# Altium schematic sheet dsau-micro-zed-bank35.SchDoc: dSAU Motherboard - uZed BANK35
size Letter; Engineer: Christopher J. Woodall; Organization: Boston University EDF/ECE; DocumentNumber: 9; Revision: A; SheetNumber: 9; SheetTotal: 10; EMAIL: cwoodall@bu.edu; TeamName: Team 19; ProjectName: dSAU
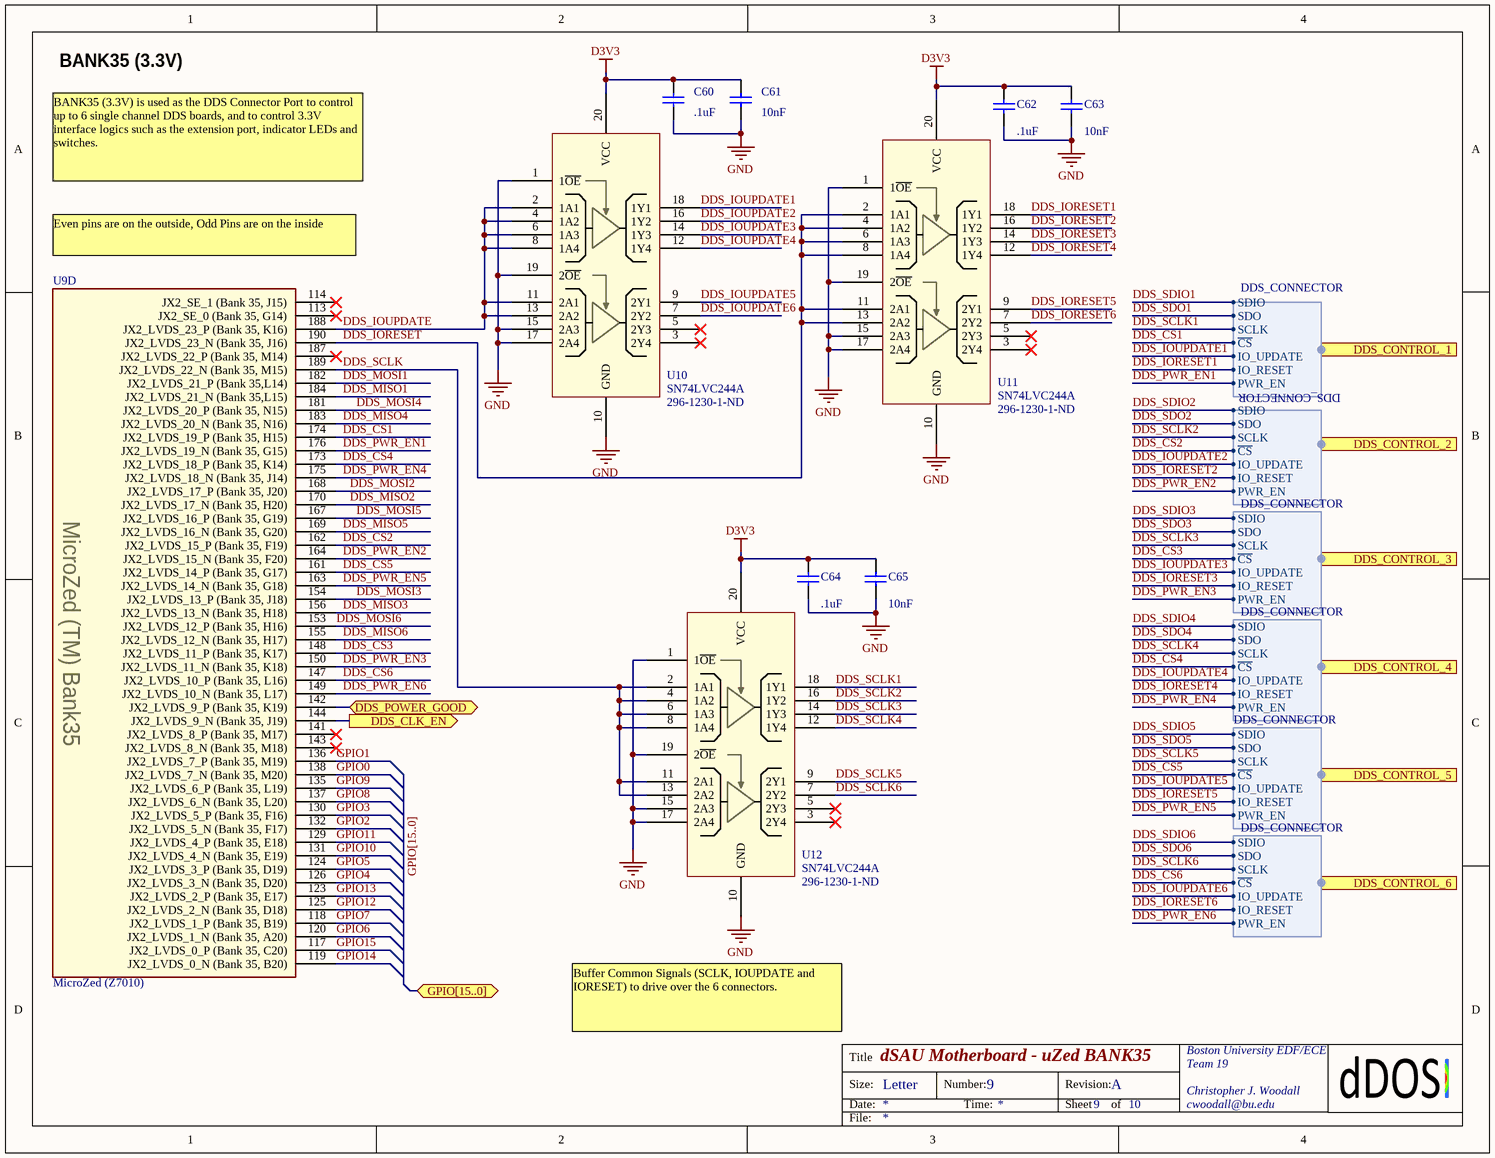
[diagram p0: dsau-micro-zed-bank35.SchDoc]

## Parts
C60  value .1uF  [CAPC1608L]  (hidden comment: CER 0.1UF 50V Y5V)
C61  value 10nF  [CAPC1608L]  (hidden comment: CER 10NF 25V 10% NP0)
C62  value .1uF  [CAPC1608L]  (hidden comment: CER 0.1UF 50V Y5V)
C63  value 10nF  [CAPC1608L]  (hidden comment: CER 10NF 25V 10% NP0)
C64  value .1uF  [CAPC1608L]  (hidden comment: CER 0.1UF 50V Y5V)
C65  value 10nF  [CAPC1608L]  (hidden comment: CER 10NF 25V 10% NP0)
U9  MicroZed (Z7010)  [MicroZed_MatingSide]  (part D of 5)
U10  SN74LVC244A  Supplier Part Number 1: 296-1230-1-ND  [TSOP64P640X120-20N]
U11  SN74LVC244A  Supplier Part Number 1: 296-1230-1-ND  [TSOP64P640X120-20N]
U12  SN74LVC244A  Supplier Part Number 1: 296-1230-1-ND  [TSOP64P640X120-20N]

## Ports
DDS_CLK_EN (out), DDS_CONTROL_1 (harness DDS_CONNECTOR), DDS_CONTROL_2 (harness DDS_CONNECTOR), DDS_CONTROL_3 (harness DDS_CONNECTOR), DDS_CONTROL_4 (harness DDS_CONNECTOR), DDS_CONTROL_5 (harness DDS_CONNECTOR), DDS_CONTROL_6 (harness DDS_CONNECTOR), DDS_POWER_GOOD, GPIO[15..0] (bidir)

## Harnesses
DDS_CONNECTOR: SDIO, SDO, SCLK, ~{CS}, IO_UPDATE, IO_RESET, PWR_EN

## Nets
D3V3: C60.2 C61.1 C62.2 C63.1 C64.2 C65.1 U10.20(VCC) U11.20(VCC) U12.20(VCC)
GND: C60.1 C61.2 C62.1 C63.2 C64.1 C65.2 U10.1(1~{OE}) U10.10(GND) U10.15(2A3) U10.17(2A4) U10.19(2~{OE}) U11.1(1~{OE}) U11.10(GND) U11.15(2A3) U11.17(2A4) U11.19(2~{OE}) U12.1(1~{OE}) U12.10(GND) U12.15(2A3) U12.17(2A4) U12.19(2~{OE})
DDS_CLK_EN: U9.144(JX2_LVDS_9_N_(Bank_35,_J19)) ; port DDS_CLK_EN
DDS_CS1: U9.174(JX2_LVDS_19_P_(Bank_35,_H15)) ; port DDS_CONTROL_1.~{CS}
DDS_CS2: U9.162(JX2_LVDS_15_P_(Bank_35,_F19)) ; port DDS_CONTROL_2.~{CS}
DDS_CS3: U9.148(JX2_LVDS_11_P_(Bank_35,_K17)) ; port DDS_CONTROL_3.~{CS}
DDS_CS4: U9.173(JX2_LVDS_18_P_(Bank_35,_K14)) ; port DDS_CONTROL_4.~{CS}
DDS_CS5: U9.161(JX2_LVDS_14_P_(Bank_35,_G17)) ; port DDS_CONTROL_5.~{CS}
DDS_CS6: U9.147(JX2_LVDS_10_P_(Bank_35,_L16)) ; port DDS_CONTROL_6.~{CS}
DDS_IORESET: U9.190(JX2_LVDS_23_N_(Bank_35,_J16)) U11.2(1A1) U11.4(1A2) U11.6(1A3) U11.8(1A4) U11.11(2A1) U11.13(2A2)
DDS_IORESET1: U11.18(1Y1) ; port DDS_CONTROL_1.IO_RESET
DDS_IORESET2: U11.16(1Y2) ; port DDS_CONTROL_2.IO_RESET
DDS_IORESET3: U11.14(1Y3) ; port DDS_CONTROL_3.IO_RESET
DDS_IORESET4: U11.12(1Y4) ; port DDS_CONTROL_4.IO_RESET
DDS_IORESET5: U11.9(2Y1) ; port DDS_CONTROL_5.IO_RESET
DDS_IORESET6: U11.7(2Y2) ; port DDS_CONTROL_6.IO_RESET
DDS_IOUPDATE: U9.188(JX2_LVDS_23_P_(Bank_35,_K16)) U10.2(1A1) U10.4(1A2) U10.6(1A3) U10.8(1A4) U10.11(2A1) U10.13(2A2)
DDS_IOUPDATE1: U10.18(1Y1) ; port DDS_CONTROL_1.IO_UPDATE
DDS_IOUPDATE2: U10.16(1Y2) ; port DDS_CONTROL_2.IO_UPDATE
DDS_IOUPDATE3: U10.14(1Y3) ; port DDS_CONTROL_3.IO_UPDATE
DDS_IOUPDATE4: U10.12(1Y4) ; port DDS_CONTROL_4.IO_UPDATE
DDS_IOUPDATE5: U10.9(2Y1) ; port DDS_CONTROL_5.IO_UPDATE
DDS_IOUPDATE6: U10.7(2Y2) ; port DDS_CONTROL_6.IO_UPDATE
DDS_MISO1: U9.184(JX2_LVDS_21_N_(Bank_35,L15))
DDS_MISO2: U9.170(JX2_LVDS_17_N_(Bank_35,_H20))
DDS_MISO3: U9.156(JX2_LVDS_13_N_(Bank_35,_H18))
DDS_MISO4: U9.183(JX2_LVDS_20_N_(Bank_35,_N16))
DDS_MISO5: U9.169(JX2_LVDS_16_N_(Bank_35,_G20))
DDS_MISO6: U9.155(JX2_LVDS_12_N_(Bank_35,_H17))
DDS_MOSI1: U9.182(JX2_LVDS_21_P_(Bank_35,L14))
DDS_MOSI2: U9.168(JX2_LVDS_17_P_(Bank_35,_J20))
DDS_MOSI3: U9.154(JX2_LVDS_13_P_(Bank_35,_J18))
DDS_MOSI4: U9.181(JX2_LVDS_20_P_(Bank_35,_N15))
DDS_MOSI5: U9.167(JX2_LVDS_16_P_(Bank_35,_G19))
DDS_MOSI6: U9.153(JX2_LVDS_12_P_(Bank_35,_H16))
DDS_POWER_GOOD: U9.142(JX2_LVDS_9_P_(Bank_35,_K19)) ; port DDS_POWER_GOOD
DDS_PWR_EN1: U9.176(JX2_LVDS_19_N_(Bank_35,_G15)) ; port DDS_CONTROL_1.PWR_EN
DDS_PWR_EN2: U9.164(JX2_LVDS_15_N_(Bank_35,_F20)) ; port DDS_CONTROL_2.PWR_EN
DDS_PWR_EN3: U9.150(JX2_LVDS_11_N_(Bank_35,_K18)) ; port DDS_CONTROL_3.PWR_EN
DDS_PWR_EN4: U9.175(JX2_LVDS_18_N_(Bank_35,_J14)) ; port DDS_CONTROL_4.PWR_EN
DDS_PWR_EN5: U9.163(JX2_LVDS_14_N_(Bank_35,_G18)) ; port DDS_CONTROL_5.PWR_EN
DDS_PWR_EN6: U9.149(JX2_LVDS_10_N_(Bank_35,_L17)) ; port DDS_CONTROL_6.PWR_EN
DDS_SCLK: U9.189(JX2_LVDS_22_N_(Bank_35,_M15)) U12.2(1A1) U12.4(1A2) U12.6(1A3) U12.8(1A4) U12.11(2A1) U12.13(2A2)
DDS_SCLK1: U12.18(1Y1) ; port DDS_CONTROL_1.SCLK
DDS_SCLK2: U12.16(1Y2) ; port DDS_CONTROL_2.SCLK
DDS_SCLK3: U12.14(1Y3) ; port DDS_CONTROL_3.SCLK
DDS_SCLK4: U12.12(1Y4) ; port DDS_CONTROL_4.SCLK
DDS_SCLK5: U12.9(2Y1) ; port DDS_CONTROL_5.SCLK
DDS_SCLK6: U12.7(2Y2) ; port DDS_CONTROL_6.SCLK
DDS_SDIO1: port DDS_CONTROL_1.SDIO
DDS_SDIO2: port DDS_CONTROL_2.SDIO
DDS_SDIO3: port DDS_CONTROL_3.SDIO
DDS_SDIO4: port DDS_CONTROL_4.SDIO
DDS_SDIO5: port DDS_CONTROL_5.SDIO
DDS_SDIO6: port DDS_CONTROL_6.SDIO
DDS_SDO1: port DDS_CONTROL_1.SDO
DDS_SDO2: port DDS_CONTROL_2.SDO
DDS_SDO3: port DDS_CONTROL_3.SDO
DDS_SDO4: port DDS_CONTROL_4.SDO
DDS_SDO5: port DDS_CONTROL_5.SDO
DDS_SDO6: port DDS_CONTROL_6.SDO
GPIO0: U9.138(JX2_LVDS_7_N_(Bank_35,_M20))
GPIO1: U9.136(JX2_LVDS_7_P_(Bank_35,_M19))
GPIO2: U9.132(JX2_LVDS_5_N_(Bank_35,_F17))
GPIO3: U9.130(JX2_LVDS_5_P_(Bank_35,_F16))
GPIO4: U9.126(JX2_LVDS_3_N_(Bank_35,_D20))
GPIO5: U9.124(JX2_LVDS_3_P_(Bank_35,_D19))
GPIO6: U9.120(JX2_LVDS_1_N_(Bank_35,_A20))
GPIO7: U9.118(JX2_LVDS_1_P_(Bank_35,_B19))
GPIO8: U9.137(JX2_LVDS_6_N_(Bank_35,_L20))
GPIO9: U9.135(JX2_LVDS_6_P_(Bank_35,_L19))
GPIO10: U9.131(JX2_LVDS_4_N_(Bank_35,_E19))
GPIO11: U9.129(JX2_LVDS_4_P_(Bank_35,_E18))
GPIO12: U9.125(JX2_LVDS_2_N_(Bank_35,_D18))
GPIO13: U9.123(JX2_LVDS_2_P_(Bank_35,_E17))
GPIO14: U9.119(JX2_LVDS_0_N_(Bank_35,_B20))
GPIO15: U9.117(JX2_LVDS_0_P_(Bank_35,_C20))

Not connected (* = marked no-connect by the designer): U9 113(JX2_SE_0_(Bank_35,_G14))* 114(JX2_SE_1_(Bank_35,_J15))* 141(JX2_LVDS_8_P_(Bank_35,_M17))* 143(JX2_LVDS_8_N_(Bank_35,_M18))* 187(JX2_LVDS_22_P_(Bank_35,_M14))*; U10 3(2Y4)* 5(2Y3)*; U11 3(2Y4)* 5(2Y3)*; U12 3(2Y4)* 5(2Y3)*

## Buses and harness runs
bus GPIO[15..0] = port GPIO[15..0]

## Notes on the sheet
- BANK35 (3.3V)
- BANK35 (3.3V) is used as the DDS Connector Port to control up to 6 single channel DDS boards, and to control 3.3V interface logics such as the extension port, indicator LEDs and switches.
- (near U9) Even pins are on the outside, Odd Pins are on the inside
- Buffer Common Signals (SCLK, IOUPDATE and IORESET) to drive over the 6 connectors.
- Title
- Size:
- Date:
- Letter
- Number:
- Time:
- Revision:
- Sheet
- of
- File:
- (in symbol MicroZed, part D) MicroZed (TM) Bank35

## Library data of the parts
C60 C62 C64 = Cap: Capacitor; Manufacturer: Yageo; Manufacturer Part Number: CC0603ZRY5V9BB104; Published: 8-Jun-2000; LatestRevisionDate: 17-Jul-2002; LatestRevisionNote: Re-released for DXP Platform.; PackageReference: RAD-0.3; Publisher: Altium Limited; Supplier 1: Digi-Key; Supplier Part Number 1: 311-1343-1-ND
C61 C63 C65 = Cap: Capacitor; Manufacturer: Kemet; Manufacturer Part Number: C0603C103K3GACTU; Published: 8-Jun-2000; LatestRevisionDate: 17-Jul-2002; LatestRevisionNote: Re-released for DXP Platform.; PackageReference: RAD-0.3; Publisher: Altium Limited; Supplier 1: Digi-Key; Supplier Part Number 1: 399-8987-1-ND
U9 = MicroZed: MicroZed is a low-cost development board based on the Xilinx Zynq-7000 All Programmable SoC. Its unique design allows it to be used as both a stand-alone evaluation board for basic SoC experimentation, or combined with a carrier card as an embeddable syst; Manufacturer: Avnet; Manfacturer Part Number: AES-Z7MB-7Z010-G; Supplier 1: Avnet; Supplier Part Number 1: AES-Z7MB-7Z010-G; Supplier 2: Mouser; Supplier Part Number 2: 649-61083-101400LF
U10-U12 = SN74LVC244A: This octal buffer/line driver is operational at 1.5-V to  3.6-V V CC , but is designed specifically for 1.65-V to  3.6-V V CC operation; Manufacturer: Texas Instruments; Supplier 1: Digi-key; Manufacturer Part Number: SN74LVC244A